# Altium schematic sheet IBVG-GENERATOR.SchDoc
size Tabloid; SheetNumber: 5; SheetTotal: 5
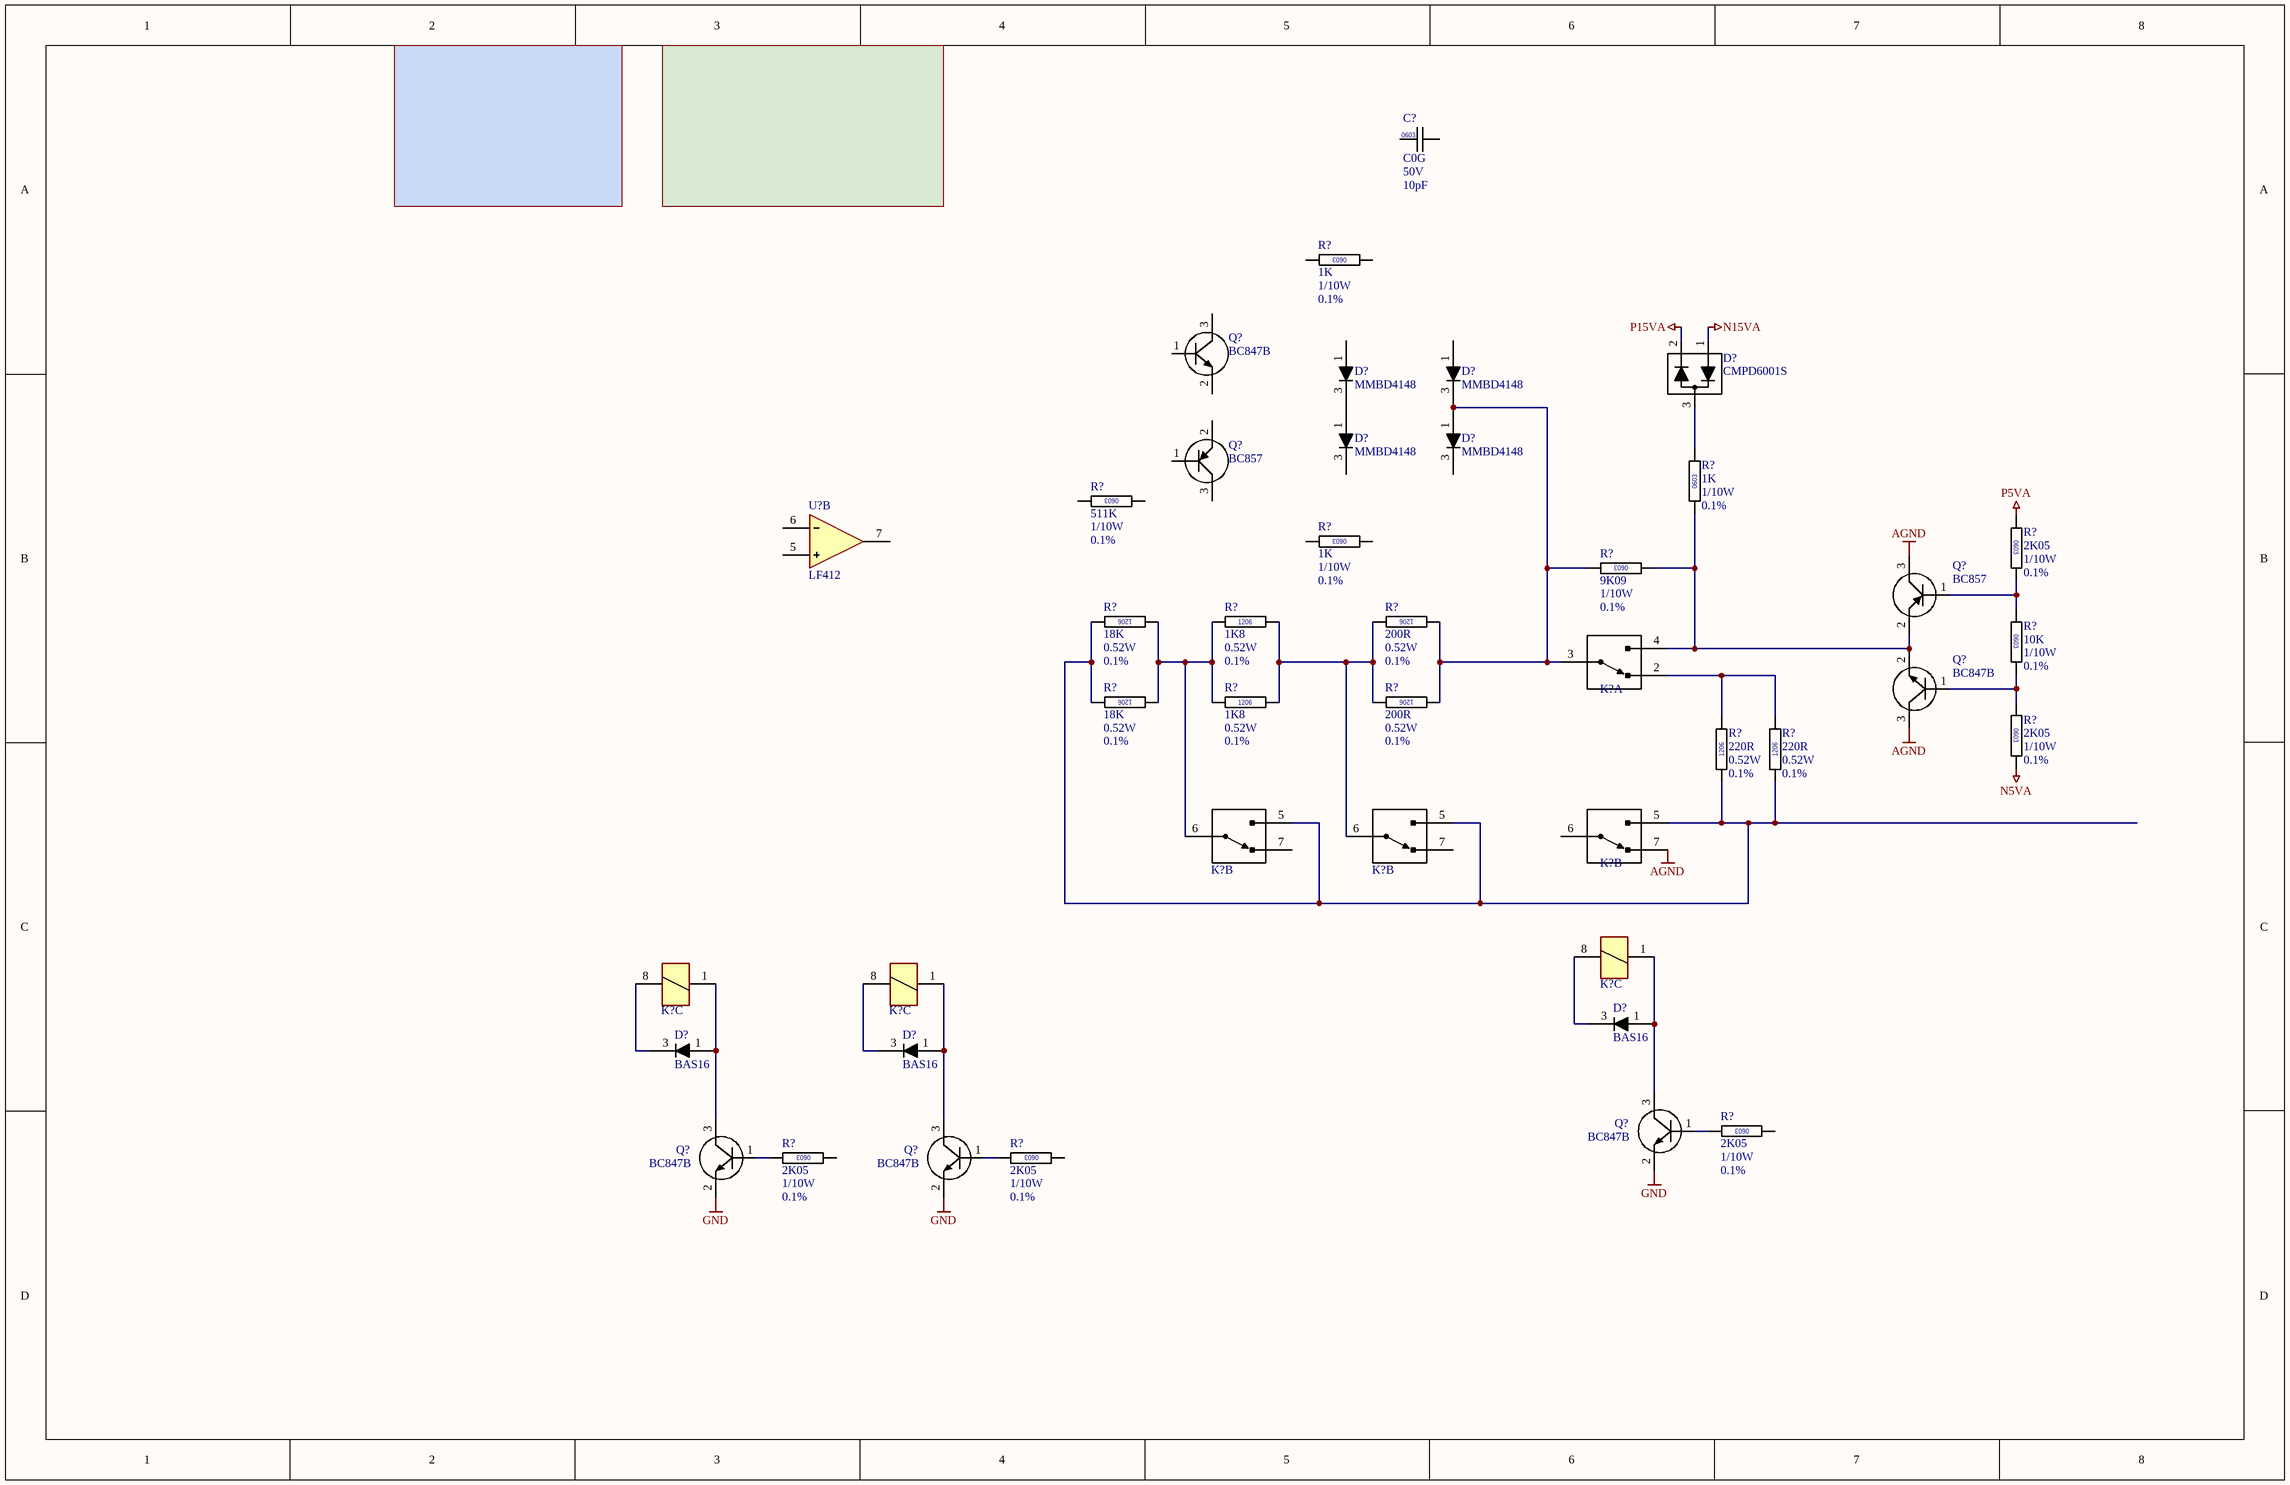
[diagram p0: IBVG-GENERATOR.SchDoc]

## Parts
(Parts that share a designator on the sheet are numbered #1, #2 ... from top to bottom, then left to right.)
C?  Dielectric: C0G  Voltage: 50V  Capacitance: 10pF  [CAPC0603]  (hidden comment: CAP0603)
D?#1  CMPD6001S  [SOT23]
D?#2  MMBD4148
D?#3  MMBD4148
D?#4  MMBD4148
D?#5  MMBD4148
D?#6  BAS16
D?#7  BAS16
D?#8  BAS16
K?#1  RELA-OMRON-OMRON G6K-2F-Y-TR DC5  (value not drawn)  (part A of 3)
K?#2  RELA-OMRON-OMRON G6K-2F-Y-TR DC5  (value not drawn)  (part B of 3)
K?#3  RELA-OMRON-OMRON G6K-2F-Y-TR DC5  (value not drawn)  (part B of 3)
K?#4  RELA-OMRON-OMRON G6K-2F-Y-TR DC5  (value not drawn)  (part B of 3)
K?#5  RELA-OMRON-OMRON G6K-2F-Y-TR DC5  (value not drawn)  (part C of 3)
K?#6  RELA-OMRON-OMRON G6K-2F-Y-TR DC5  (value not drawn)  (part C of 3)
K?#7  RELA-OMRON-OMRON G6K-2F-Y-TR DC5  (value not drawn)  (part C of 3)
Q?#1  BC847B  [SOT23]
Q?#2  BC857  [SOT23]
Q?#3  BC857  [SOT23]
Q?#4  BC847B  [SOT23]
Q?#5  BC847B  [SOT23]
Q?#6  BC847B  [SOT23]
Q?#7  BC847B  [SOT23]
R?#1  value 1K  Power: 1/10W  Tolerance: 0.1%  [RESC0603]  (hidden comment: RESC0603)
R?#2  value 1K  Power: 1/10W  Tolerance: 0.1%  [RESC0603]  (hidden comment: RESC0603)
R?#3  value 511K  Power: 1/10W  Tolerance: 0.1%  [RESC0603]  (hidden comment: RESC0603)
R?#4  value 2K05  Power: 1/10W  Tolerance: 0.1%  [RESC0603]  (hidden comment: RESC0603)
R?#5  value 1K  Power: 1/10W  Tolerance: 0.1%  [RESC0603]  (hidden comment: RESC0603)
R?#6  value 9K09  Power: 1/10W  Tolerance: 0.1%  [RESC0603]  (hidden comment: RESC0603)
R?#7  value 18K  Power: 0.52W  Tolerance: 0.1%  [RESC1206]  (hidden comment: RESC1206)
R?#8  value 1K8  Power: 0.52W  Tolerance: 0.1%  [RESC1206]  (hidden comment: RESC1206)
R?#9  value 200R  Power: 0.52W  Tolerance: 0.1%  [RESC1206]  (hidden comment: RESC1206)
R?#10  value 10K  Power: 1/10W  Tolerance: 0.1%  [RESC0603]  (hidden comment: RESC0603)
R?#11  value 18K  Power: 0.52W  Tolerance: 0.1%  [RESC1206]  (hidden comment: RESC1206)
R?#12  value 1K8  Power: 0.52W  Tolerance: 0.1%  [RESC1206]  (hidden comment: RESC1206)
R?#13  value 200R  Power: 0.52W  Tolerance: 0.1%  [RESC1206]  (hidden comment: RESC1206)
R?#14  value 2K05  Power: 1/10W  Tolerance: 0.1%  [RESC0603]  (hidden comment: RESC0603)
R?#15  value 220R  Power: 0.52W  Tolerance: 0.1%  [RESC1206]  (hidden comment: RESC1206)
R?#16  value 220R  Power: 0.52W  Tolerance: 0.1%  [RESC1206]  (hidden comment: RESC1206)
R?#17  value 2K05  Power: 1/10W  Tolerance: 0.1%  [RESC0603]  (hidden comment: RESC0603)
R?#18  value 2K05  Power: 1/10W  Tolerance: 0.1%  [RESC0603]  (hidden comment: RESC0603)
R?#19  value 2K05  Power: 1/10W  Tolerance: 0.1%  [RESC0603]  (hidden comment: RESC0603)
U?  LF412  (part B of 3)

## Nets
AGND: K?#4.7(NC) Q?#3.3(C) Q?#4.3(C)
GND: Q?#5.2(E) Q?#6.2(E) Q?#7.2(E)
N5VA: R?#14.2
N15VA: D?#1.1(K)
P5VA: R?#4.1
P15VA: D?#1.2(A)
NetD?#1_3: D?#1.3(A) R?#2.1
NetD?#2_3: D?#2.3(K) D?#4.1(A)
NetD?#3_3: D?#3.3(K) D?#5.1(A) K?#1.3(COM) R?#6.1 R?#9.1 R?#13.1
NetD?#6_1: D?#6.1(A) K?#5.1 Q?#5.3(C)
NetD?#6_3: D?#6.3(K) K?#5.8
NetD?#7_1: D?#7.1(A) K?#6.1 Q?#6.3(C)
NetD?#7_3: D?#7.3(K) K?#6.8
NetD?#8_1: D?#8.1(A) K?#7.1 Q?#7.3(C)
NetD?#8_3: D?#8.3(K) K?#7.8
NetK?#1_2: K?#1.2(NC) R?#15.1 R?#16.1
NetK?#1_4: K?#1.4(NO) Q?#3.2(E) Q?#4.2(E) R?#2.2 R?#6.2
NetK?#2_5: K?#2.5(NO) K?#3.5(NO) K?#4.5(NO) R?#7.2 R?#11.2 R?#15.2 R?#16.2
NetK?#2_6: K?#2.6(COM) R?#7.1 R?#8.1 R?#11.1 R?#12.1
NetK?#3_6: K?#3.6(COM) R?#8.2 R?#9.2 R?#12.2 R?#13.2
NetQ?#3_1: Q?#3.1(B) R?#4.2 R?#10.2
NetQ?#4_1: Q?#4.1(B) R?#10.1 R?#14.1
NetQ?#5_1: Q?#5.1(B) R?#17.2
NetQ?#6_1: Q?#6.1(B) R?#18.2
NetQ?#7_1: Q?#7.1(B) R?#19.2

Not connected (* = marked no-connect by the designer): C? 1 2; D?#2 1(A); D?#3 1(A); D?#4 3(K); D?#5 3(K); K?#2 7(NC); K?#3 7(NC); K?#4 6(COM); Q?#1 1(B) 2(E) 3(C); Q?#2 1(B) 2(E) 3(C); R?#1 1 2; R?#3 1 2; R?#5 1 2; R?#17 1; R?#18 1; R?#19 1; U? 5(+) 6(-) 7(O)

## Notes on the sheet
- (in symbol RESC-0603-1K-0.1%-1/10W) 0603
- (in symbol RESC-0603-2K05-0.1%-1/10W) 0603
- (in symbol RESC-0603-9K09-0.1%-1/10W) 0603
- (in symbol RESC-0603-10K-0.1%-1/10W) 0603
- (in symbol RESC-0603-511K-0.1%-1/10W) 0603
- (in symbol RESC-1206-1K8-0.1%-1/2W) 1206
- (in symbol RESC-1206-18K-0.1%-1/2W) 1206
- (in symbol RESC-1206-200R-0.1%-1/2W) 1206
- (in symbol RESC-1206-220R-0.1%-1/2W) 1206

## Library data of the parts
C? = CAPC-0603-10PF-50V-C0G: CAPACITOR,CERAMIC,10pF,50V,C0G,0603; Manufacturer 1: KYOCERA; Manufacturer Part Number 1: C0603C100J5GAC; Package / Case: 0603; Location: *; MOUSER: 80-C0603C100J5GAC
D?#1 = DIODE-CENTRALSEMI-CMPD6001S: DIODE,75V,250mA,SOT23,500pA ULTRA LOW LEAKAGE; Manufacturer 1: CENTRAL SEMICONDUCTOR; Manufacturer Part Number 1: CMPD6001S
D?#2-D?#5 = DIODE-RECTIFIER-DIODES-MMBD4148-SOT23: DIODE,RECTIFIER,75V,0.3A,MMBD4148,SOT23; Manufacturer 1: DIODES; Manufacturer Part Number 1: MMBD4148
D?#6-D?#8 = DIODE-RECTIFIER-DIODES-BAS16-SOT23: DIODE,RECTIFIER,75V,0.3A,BAS16,SOT23; Manufacturer 1: DIODES; Manufacturer Part Number 1: MMBD4148
Q?#1 Q?#4-Q?#7 = XSTR-NPN-BC847: XSTR,NPN,45V,0.1A,,BC847B,SOT23
Q?#2 Q?#3 = XSTR-PNP-BC857: XSTR,PNP,SOT23,BC857,SOT23
R?#1 R?#2 R?#5 = RESC-0603-1K-0.1%-1/10W: RESISTOR,1K,0.1%,100mW,0603 (1608); Location: *
R?#3 = RESC-0603-511K-0.1%-1/10W: RESISTOR,511K,0.1%,100mW,0603 (1608); Location: *
R?#4 R?#14 R?#17-R?#19 = RESC-0603-2K05-0.1%-1/10W: RESISTOR,2K05,0.11%,100mW,0603 (1608); Location: *
R?#6 = RESC-0603-9K09-0.1%-1/10W: RESISTOR,9K09,0.1%,100mW,0603 (1608); Location: *
R?#7 R?#11 = RESC-1206-18K-0.1%-1/2W: RESISTOR,18K,1206,0.1%,520mW,1206; Manufacturer 1: VISHAY; Manufacturer Part Number 1: TNPW1206220RBEEA; Location: *; Parameter 4: *
R?#8 R?#12 = RESC-1206-1K8-0.1%-1/2W: RESISTOR,1K8,1206,0.1%,520mW,1206; Manufacturer 1: VISHAY; Manufacturer Part Number 1: TNPW12061K80BEEA; Location: *; Parameter 4: *
R?#9 R?#13 = RESC-1206-200R-0.1%-1/2W: RESISTOR,200R,1206,0.1%,520mW,1206; Manufacturer 1: VISHAY; Manufacturer Part Number 1: TNPW1206200RBEEA; Location: *; Parameter 4: *
R?#10 = RESC-0603-10K-0.1%-1/10W: RESISTOR,10K,0.1%,100mW,0603 (1608); Location: *
R?#15 R?#16 = RESC-1206-220R-0.1%-1/2W: RESISTOR,220R,1206,0.1%,520mW,1206; Manufacturer 1: VISHAY; Manufacturer Part Number 1: TNPW1206220RBEEA; Location: *; Parameter 4: *
U? = IC-TI-LF412-DIL8: IC,OPAMP JFET,DUAL,LF412,DIL8